# Altium schematic sheet SensorNode.SchDoc
size A4
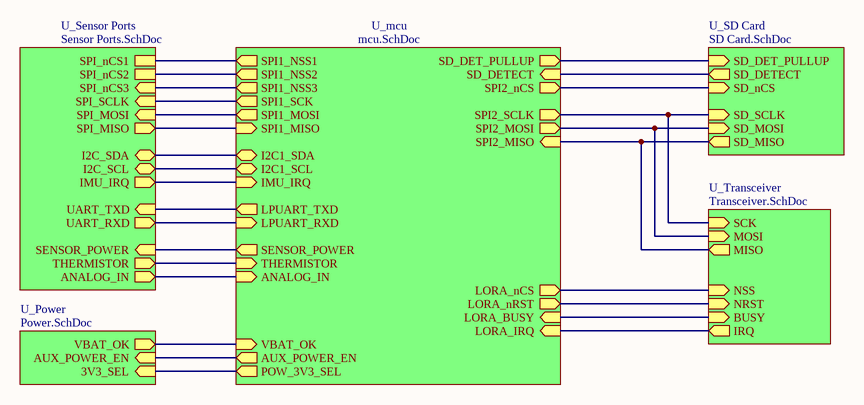
[diagram p0: SensorNode.SchDoc]

## Sub-sheets
U_mcu = mcu.SchDoc: SPI1_SCK (out), SPI1_MISO (in), SPI1_MOSI (out), I2C1_SDA (bidir), SPI2_MOSI (out), SPI2_MISO (in), SPI2_SCLK (out), SPI2_nCS (out), SD_DET_PULLUP (out), SD_DETECT (in), LORA_nCS (out), LORA_nRST (out), LORA_BUSY (in), LORA_IRQ (in), I2C1_SCL (bidir), AUX_POWER_EN (out), VBAT_OK (in), POW_3V3_SEL (out), LPUART_TXD (out), LPUART_RXD (in), SPI1_NSS1 (out), SPI1_NSS2 (out), SPI1_NSS3 (out), ANALOG_IN (in), THERMISTOR (in), SENSOR_POWER (out), IMU_IRQ (in)
U_Power = Power.SchDoc: VBAT_OK (out), AUX_POWER_EN (in), 3V3_SEL (in)
U_SD Card = SD Card.SchDoc: SD_nCS (in), SD_MOSI (in), SD_SCLK (in), SD_MISO (out), SD_DET_PULLUP (in), SD_DETECT (out)
U_Sensor Ports = Sensor Ports.SchDoc: I2C_SDA (bidir), I2C_SCL (bidir), UART_TXD (in), UART_RXD (out), SPI_MOSI (in), SPI_SCLK (in), SPI_MISO (out), SPI_nCS3 (in), SPI_nCS1, SPI_nCS2, SENSOR_POWER (in), ANALOG_IN (out), THERMISTOR (out), IMU_IRQ (out)
U_Transceiver = Transceiver.SchDoc: SCK (in), NRST (in), BUSY (in), MOSI (in), NSS (in), MISO (out), IRQ (out)

## Nets
(unnamed): sheet U_mcu/SPI1_SCK, sheet U_Sensor Ports/SPI_SCLK
(unnamed): sheet U_mcu/SPI1_MISO, sheet U_Sensor Ports/SPI_MISO
(unnamed): sheet U_mcu/SPI1_MOSI, sheet U_Sensor Ports/SPI_MOSI
(unnamed): sheet U_mcu/I2C1_SDA, sheet U_Sensor Ports/I2C_SDA
(unnamed): sheet U_mcu/SPI2_MOSI, sheet U_SD Card/SD_MOSI, sheet U_Transceiver/MOSI
(unnamed): sheet U_mcu/SPI2_MISO, sheet U_SD Card/SD_MISO, sheet U_Transceiver/MISO
(unnamed): sheet U_mcu/SPI2_SCLK, sheet U_SD Card/SD_SCLK, sheet U_Transceiver/SCK
(unnamed): sheet U_mcu/SPI2_nCS, sheet U_SD Card/SD_nCS
(unnamed): sheet U_mcu/SD_DET_PULLUP, sheet U_SD Card/SD_DET_PULLUP
(unnamed): sheet U_mcu/SD_DETECT, sheet U_SD Card/SD_DETECT
(unnamed): sheet U_mcu/LORA_nCS, sheet U_Transceiver/NSS
(unnamed): sheet U_mcu/LORA_nRST, sheet U_Transceiver/NRST
(unnamed): sheet U_mcu/LORA_BUSY, sheet U_Transceiver/BUSY
(unnamed): sheet U_mcu/LORA_IRQ, sheet U_Transceiver/IRQ
(unnamed): sheet U_mcu/I2C1_SCL, sheet U_Sensor Ports/I2C_SCL
(unnamed): sheet U_mcu/AUX_POWER_EN, sheet U_Power/AUX_POWER_EN
(unnamed): sheet U_mcu/VBAT_OK, sheet U_Power/VBAT_OK
(unnamed): sheet U_mcu/POW_3V3_SEL, sheet U_Power/3V3_SEL
(unnamed): sheet U_mcu/LPUART_TXD, sheet U_Sensor Ports/UART_TXD
(unnamed): sheet U_mcu/LPUART_RXD, sheet U_Sensor Ports/UART_RXD
(unnamed): sheet U_mcu/SPI1_NSS1, sheet U_Sensor Ports/SPI_nCS1
(unnamed): sheet U_mcu/SPI1_NSS2, sheet U_Sensor Ports/SPI_nCS2
(unnamed): sheet U_mcu/SPI1_NSS3, sheet U_Sensor Ports/SPI_nCS3
(unnamed): sheet U_mcu/ANALOG_IN, sheet U_Sensor Ports/ANALOG_IN
(unnamed): sheet U_mcu/THERMISTOR, sheet U_Sensor Ports/THERMISTOR
(unnamed): sheet U_mcu/SENSOR_POWER, sheet U_Sensor Ports/SENSOR_POWER
(unnamed): sheet U_mcu/IMU_IRQ, sheet U_Sensor Ports/IMU_IRQ